# Altium schematic sheet Master.SchDoc
size A4; Author: Jeremiah Lilland; CompanyName: Pinebox Effects; DrawnBy: Jeremiah Lilland; Revision: 1.0
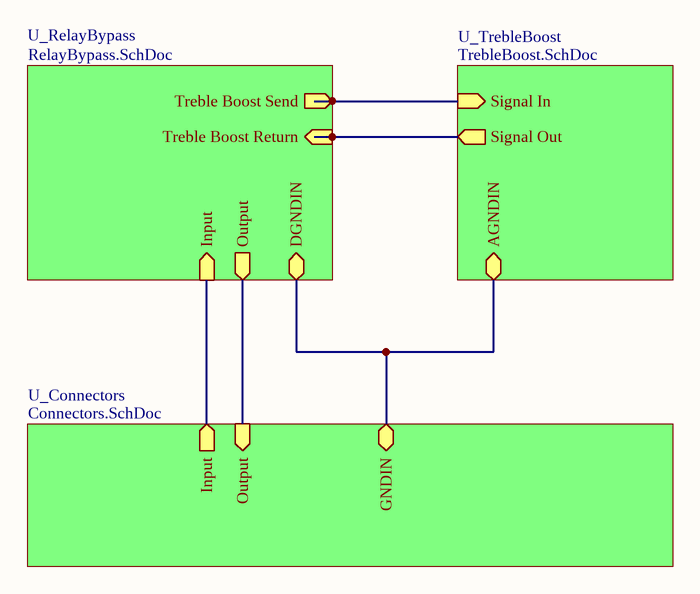
[diagram p0: Master.SchDoc]

## Sub-sheets
U_Connectors = Connectors.SchDoc: Input (out), Output (in), GNDIN (bidir)
U_RelayBypass = RelayBypass.SchDoc: Treble Boost Send (out), Treble Boost Return (in), Input (in), Output (out), DGNDIN
U_TrebleBoost = TrebleBoost.SchDoc: Signal In (in), Signal Out (out), AGNDIN

## Nets
(unnamed): sheet U_RelayBypass/Treble Boost Send, sheet U_TrebleBoost/Signal In
(unnamed): sheet U_RelayBypass/Treble Boost Return, sheet U_TrebleBoost/Signal Out
(unnamed): sheet U_RelayBypass/Input, sheet U_Connectors/Input
(unnamed): sheet U_RelayBypass/Output, sheet U_Connectors/Output
(unnamed): sheet U_RelayBypass/DGNDIN, sheet U_TrebleBoost/AGNDIN, sheet U_Connectors/GNDIN

## Notes on the sheet
- Sheet Title:
- Project Title:
- Date:
- Revision:
- Sheet
- of
- File: